# Altium project Toffee.PrjPCB
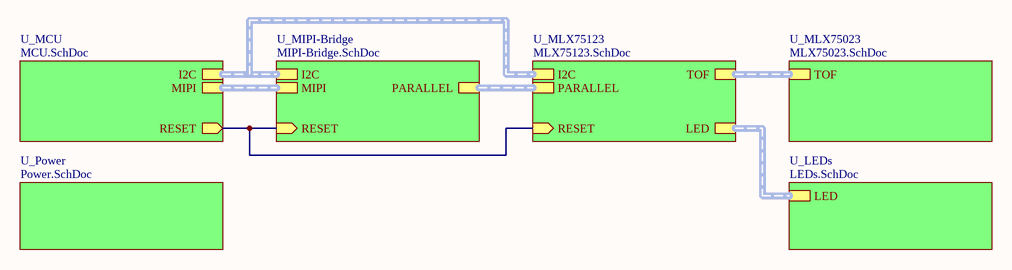
[diagram p0: Toffee.SchDoc]
7 sheets, 139 parts. Net scope: hierarchical (ports join the sheet entries above them; power ports are global).
Board file: Toffee.PcbDoc
Sheets:
  Toffee.SchDoc
    U_Power = Power.SchDoc
    U_MCU = MCU.SchDoc
    U_LEDs = LEDs.SchDoc
    U_MIPI-Bridge = MIPI-Bridge.SchDoc
    U_MLX75123 = MLX75123.SchDoc
    U_MLX75023 = MLX75023.SchDoc

## Sheet Toffee.SchDoc
size A

### Sub-sheets
U_LEDs = LEDs.SchDoc: LED (harness LED)
U_MCU = MCU.SchDoc: I2C (harness I2C), MIPI (harness MIPI), RESET (out)
U_MIPI-Bridge = MIPI-Bridge.SchDoc: I2C (harness I2C), PARALLEL (harness Parallel), MIPI (harness MIPI), RESET (in)
U_MLX75023 = MLX75023.SchDoc: TOF (harness TOF)
U_MLX75123 = MLX75123.SchDoc: PARALLEL (harness Parallel), I2C (harness I2C), TOF (harness TOF), LED (harness LED), RESET (in)
U_Power = Power.SchDoc: no entries

### Nets
NetU1_F4: sheet U_MCU/RESET, sheet U_MIPI-Bridge/RESET, sheet U_MLX75123/RESET

### Buses and harness runs
harness sheet U_LEDs/LED = sheet U_MLX75123/LED
harness sheet U_MCU/I2C = sheet U_MIPI-Bridge/I2C = sheet U_MLX75123/I2C
harness sheet U_MCU/MIPI = sheet U_MIPI-Bridge/MIPI
harness sheet U_MIPI-Bridge/PARALLEL = sheet U_MLX75123/PARALLEL
harness sheet U_MLX75023/TOF = sheet U_MLX75123/TOF

## Sheet Power.SchDoc
size A
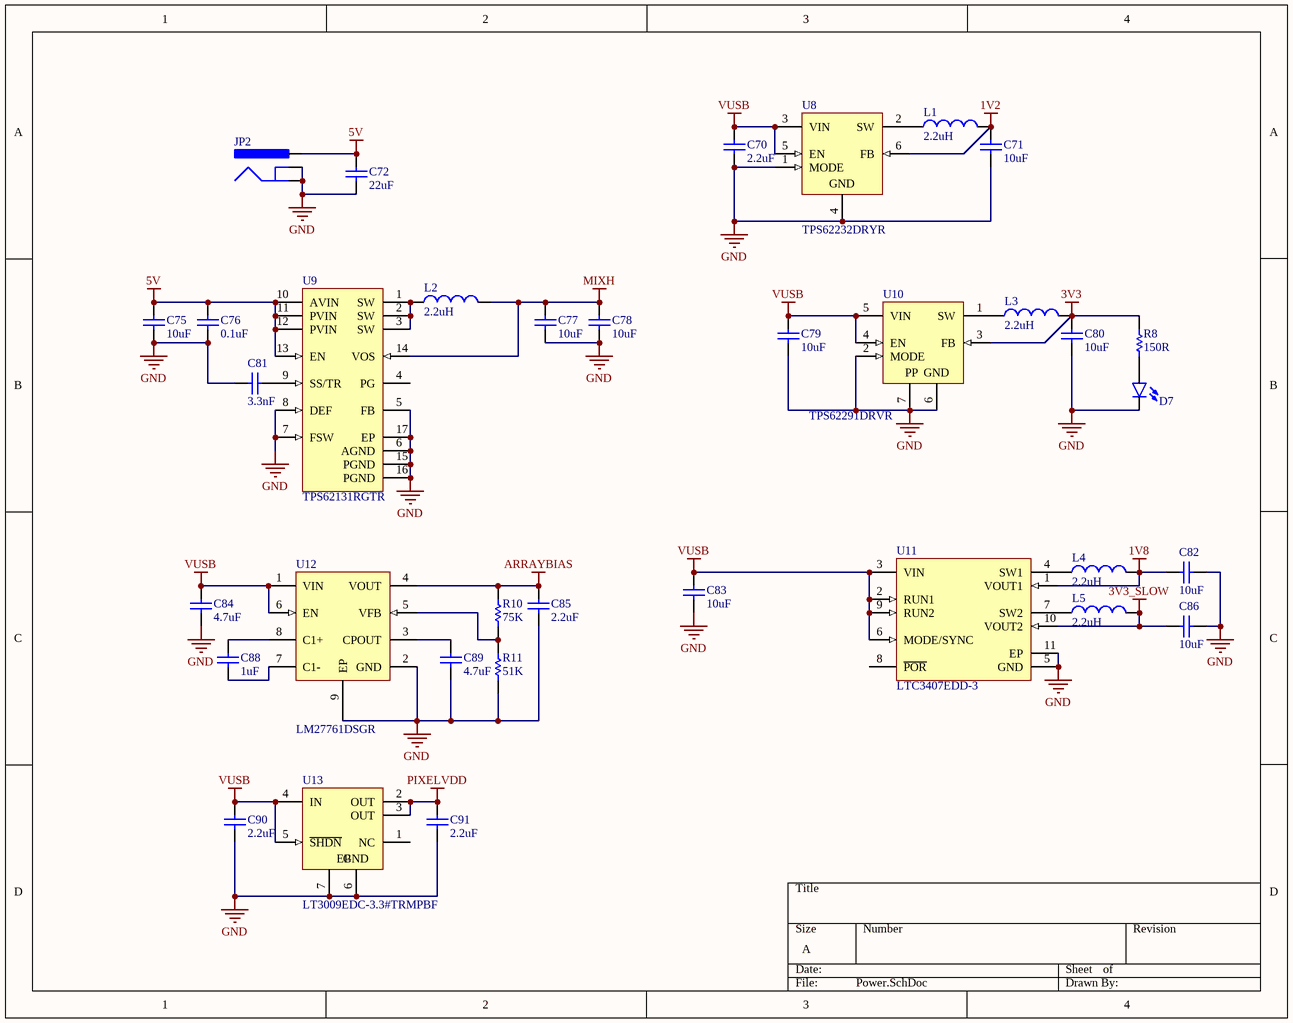
[diagram p1: Power.SchDoc]

### Parts
C70  value 2.2uF  [C0402[1005X55]]  (hidden comment: 2.2uF 6.3V 0402)
C71  value 10uF  [C0402[1005X55]]  (hidden comment: 10uF 6.3V 0402)
C72  value 22uF  [C0603[1608X92]]  (hidden comment: 22uF 6.3V 0603)
C75  value 10uF  [C0402[1005X55]]  (hidden comment: 10uF 6.3V 0402)
C76  value 0.1uF  [C0402[1005X55]]  (hidden comment: 0.1uF 6.3V 0402)
C77  value 10uF  [C0402[1005X55]]  (hidden comment: 10uF 6.3V 0402)
C78  value 10uF  [C0402[1005X55]]  (hidden comment: 10uF 6.3V 0402)
C79  value 10uF  [C0402[1005X55]]  (hidden comment: 10uF 6.3V 0402)
C80  value 10uF  [C0402[1005X55]]  (hidden comment: 10uF 6.3V 0402)
C81  value 3.3nF  [C0402[1005X55]]  (hidden comment: 3.3nF 50V 0402)
C82  value 10uF  [C0402[1005X55]]  (hidden comment: 10uF 6.3V 0402)
C83  value 10uF  [C0402[1005X55]]  (hidden comment: 10uF 6.3V 0402)
C84  value 4.7uF  [C0402[1005X55]]  (hidden comment: 4.7uF 6.3V 0402)
C85  value 2.2uF  [C0402[1005X55]]  (hidden comment: 2.2uF 6.3V 0402)
C86  value 10uF  [C0402[1005X55]]  (hidden comment: 10uF 6.3V 0402)
C88  value 1uF  [C0402[1005X55]]  (hidden comment: 1uF 6.3V 0402)
C89  value 4.7uF  [C0402[1005X55]]  (hidden comment: 4.7uF 6.3V 0402)
C90  value 2.2uF  [C0402[1005X55]]  (hidden comment: 2.2uF 6.3V 0402)
C91  value 2.2uF  [C0402[1005X55]]  (hidden comment: 2.2uF 6.3V 0402)
D7  LED_0603_BLUE_5mA  [LED0603]  (value not drawn)
JP2  POWER_JACK  [POWER-JACK-2.1X5.5MM-SMD]  (value not drawn)
L1  2.2uH  [IND0603]
L2  2.2uH  [IND1008]
L3  2.2uH  [IND0805]
L4  2.2uH  [IND0603]
L5  2.2uH  [IND0603]
R8  value 150R  [R0402[1005]]  (hidden comment: 150R 1% 0402)
R10  value 75K  [R0402[1005]]  (hidden comment: 75K 1% 0402)
R11  value 51K  [R0402[1005]]  (hidden comment: 51K 1% 0402)
U8  TPS62232DRYR  [DRY0006A]
U9  TPS62131RGTR  [RGT0016C_V]
U10  TPS62291DRVR  [WSON-6]
U11  LTC3407EDD-3  [VSON-10 (3mmx3mm)]
U12  LM27761DSGR  [WSON-8]
U13  LT3009EDC-3.3#TRMPBF  [LT-DC6-6_V]

### Nets
1V2: C71.2 L1.2 U8.6(FB)
1V8: C82.2 L4.2 U11.1(VOUT1)
3V3: C80.2 L3.2 R8.2 U10.3(FB)
3V3_SLOW: C86.1 L5.2 U11.10(VOUT2)
5V: C72.2 C75.2 C76.2 JP2.1(PWR) U9.10(AVIN) U9.11(PVIN) U9.12(PVIN) U9.13(EN)
ARRAYBIAS: C85.2 R10.2 U12.4(VOUT)
GND: C70.1 C71.1 C72.1 C75.1 C76.1 C77.1 C78.1 C79.1 C80.1 C81.1 C82.1 C83.1 C84.1 C85.1 C86.2 C89.1 C90.1 C91.1 D7.C JP2.2(GND) JP2.3(GND) R11.1 U8.1(MODE) U8.4(GND) U9.5(FB) U9.6(AGND) U9.7(FSW) U9.8(DEF) U9.15(PGND) U9.16(PGND) U9.17(EP) U10.2(MODE) U10.6(GND) U10.7(EP) U11.5(GND) U11.11(EP) U12.2(GND) U12.9(EP) U13.6(GND) U13.7(EP)
MIXH: C77.2 C78.2 L2.2 U9.14(VOS)
PIXELVDD: C91.2 U13.2(OUT) U13.3(OUT)
VUSB: C70.2 C79.2 C83.2 C84.2 C90.2 U8.3(VIN) U8.5(EN) U10.4(EN) U10.5(VIN) U11.2(RUN1) U11.3(VIN) U11.6(MODE/SYNC) U11.9(RUN2) U12.1(VIN) U12.6(EN) U13.4(IN) U13.5(~{SHDN})
NetC81_2: C81.2 U9.9(SS/TR)
NetC88_1: C88.1 U12.7(C1-)
NetC88_2: C88.2 U12.8(C1+)
NetC89_2: C89.2 U12.3(CPOUT)
NetD7_A: D7.A R8.1
NetL1_1: L1.1 U8.2(SW)
NetL2_1: L2.1 U9.1(SW) U9.2(SW) U9.3(SW)
NetL3_1: L3.1 U10.1(SW)
NetL4_1: L4.1 U11.4(SW1)
NetL5_1: L5.1 U11.7(SW2)
NetR10_1: R10.1 R11.2 U12.5(VFB)

Not connected (* = marked no-connect by the designer): U9 4(PG); U11 8(~{POR}); U13 1(NC)

### Notes on the sheet
- (in symbol TPS62291DRVR) PP

### Library data of the parts
C70 C85 C90 C91 = CAP_2.2uF_6.3V_0402_20%: 2.2uF 6.3V 20% 0402 (1005 Metric); PartNumber: GRM155R60J225ME15D; Manufacturer: Murata; Mounting Technology: Surface Mount; PackageReference: 0402; PackageDescription: 0402 (1005 Metric); Voltage: 6.3V; Tolerance: 20%
C71 C75 C77-C80 C82 C83 C86 = CAP_10uF_6.3V_0402_20%: 10uF 6.3V 20% 0402 (1005 Metric); PartNumber: GRM155R60J106ME44D; Manufacturer: Murata; Mounting Technology: Surface Mount; PackageReference: 0402; PackageDescription: 0402 (1005 Metric); Voltage: 6.3V; Tolerance: 20%
C72 = CAP_22uF_6.3V_0603_10%: 22uF 6.3V 10% 0603 (1608 Metric); PartNumber: GRT188R60J226ME13D; Manufacturer: Murata; Mounting Technology: Surface Mount; PackageReference: 0603; PackageDescription: 0603 (1608 Metric); Voltage: 6.3V; Tolerance: 10%
C76 = CAP_0.1uF_6.3V_0402_10%: 0.1uF 6.3V 10% 0402 (1005 Metric); PartNumber: GRM155R70J104KA01D; Manufacturer: Murata; Mounting Technology: Surface Mount; PackageReference: 0402; PackageDescription: 0402 (1005 Metric); Voltage: 6.3V; Tolerance: 10%
C81 = CAP_3.3nF_50V_0402_10%: 3.3nF 50V 10% 0402 (1005 Metric); PartNumber: GRM155R71H332KA01D; Manufacturer: Murata; Mounting Technology: Surface Mount; PackageReference: 0402; PackageDescription: 0402 (1005 Metric); Voltage: 50V; Tolerance: 10%
C84 C89 = CAP_4.7uF_6.3V_0402_20%: 4.7uF 6.3V 20% 0402 (1005 Metric); PartNumber: GRM155R60J475ME47D; Manufacturer: Murata; Mounting Technology: Surface Mount; PackageReference: 0402; PackageDescription: 0402 (1005 Metric); Voltage: 6.3V; Tolerance: 20%
C88 = CAP_1uF_6.3V_0402_10%: 1uF 6.3V 10% 0402 (1005 Metric); PartNumber: GRM155R70J105KA12D; Manufacturer: Murata; Mounting Technology: Surface Mount; PackageReference: 0402; PackageDescription: 0402 (1005 Metric); Voltage: 6.3V; Tolerance: 10%
D7 = LED_0603_BLUE_5mA: PartNumber: LTST-C193TBKT-5A; Manufacturer: Lite-On Inc.; PackageReference: 0603; PackageDescription: 0603 (1608 Metric); Mounting Technology: Surface Mount
JP2 = POWER_JACK: Manufacturer: CUI Inc.; PartNumber: PJ-036AH-SMT-TR; Mounting Technology: Surface Mount; PackageReference: 2X5.5MM
L1 L4 L5 = IND_2.2uH_750mA_0603_20%: 2.2uH 20% 750mA 0603; PartNumber: LQM18PZ2R2MCHD; Manufacturer: Murata; PackageReference: 0603; PackageDescription: 0603 (1608 metric); Value: 2.2uH; Mounting Technology: Surface Mount; Current: 750mA
L2 = IND_2.2uH_3.3A_1008_20%: 2.2uH 20% 3.3A 1008; PartNumber: DFE252012F-2R2M=P2; Manufacturer: Murata; PackageReference: 1008; PackageDescription: 1008 (2520 metric); Mounting Technology: Surface Mount; Current: 3.3A; Value: 2.2uH
L3 = IND_2.2uH_1.7A_0805_20%: 2.2uH 20% 1.7A 0805; PartNumber: LQM21PN2R2MGHL; Manufacturer: Murata; PackageReference: 0805; PackageDescription: 0805 (2012 metric); Value: 2.2uH; Mounting Technology: Surface Mount; Current: 1.7A
R8 = RES_150R_0402_1%: 150R 0.063W 1% 0402 (1005 Metric); Manufacturer: KOA Speer; PartNumber: RK73H1ETTP1500F; Tolerance: 1%; Power: 0.063W; Mounting Technology: Surface Mount; PackageReference: 0402; PackageDescription: 0402 (1005 Metric); ComponentLink1Description: Datasheet; ComponentLink1URL: http://www.koaspeer.com/catimages/Products/RK73H/RK73H.pdf
R10 = RES_75K_0402_1%: 75K 0.063W 1% 0402 (1005 Metric); Manufacturer: KOA Speer; PartNumber: RK73H1ETTP7502F; Tolerance: 1%; Power: 0.063W; Mounting Technology: Surface Mount; PackageReference: 0402; PackageDescription: 0402 (1005 Metric); ComponentLink1Description: Datasheet; ComponentLink1URL: http://www.koaspeer.com/catimages/Products/RK73H/RK73H.pdf
R11 = RES_51K_0402_1%: 51K 0.063W 1% 0402 (1005 Metric); Manufacturer: KOA Speer; PartNumber: RK73H1ETTP5102F; Tolerance: 1%; Power: 0.063W; Mounting Technology: Surface Mount; PackageReference: 0402; PackageDescription: 0402 (1005 Metric); ComponentLink1Description: Datasheet; ComponentLink1URL: http://www.koaspeer.com/catimages/Products/RK73H/RK73H.pdf
U8 = CMP-0323-00291-3: Buck Step Down Regulator with 2.05 to 6 V Input and 1.2 V Output, -40 to 85 degC, 6-Pin SON (DRY), Green (RoHS & no Sb/Br); Manufacturer: Texas Instruments; Synchronous Rectification: TRUE; Duty Cycle(Max)(%): 100; Iout(Max)(A): 0.5; Switch Current Limit(Typ)(A): 0.84; Vout(Min)(V): 1.2; Rating: Catalog; Vin(Max)(V): 6; SubFamily: Step-Down Regulator; Vin(Min)(V): 2.05; Iq(Typ)(mA): 0.022; Regulated Outputs(#): 1; ComponentLink1URL: http://www.ti.com/general/docs/lit/getliterature.tsp?genericPartNumber=TPS62232&fileType=pdf; ComponentLink3Description: URL Link1; PackageDescription: 6-Pin Plastic Small Outline No-Lead, 1 x 1.45 x 0.6 mm Body, 0.5 mm Pitch; ComponentLink2URL: http://www.ti.com/litv/pdf/mpds221e; Topology: Buck; DatasheetVersion: SLVS941E; PackageReference: DRY0006A; PartNumber: TPS62232DRYR; ComponentLink2Description: Package Specification; ComponentLink1Description: Datasheet; Preset Vout(V): 1.2; Mounting Technology: Surface Mount; Eco-Plan: Green (RoHS & no Sb/Br); ComponentLink3URL: Samples URL:http://www.ti.com/product/tps62232#samples; Vout(Max)(V): 1.2; PackageVersion: revF, Dec-2011
U9 = CMP-0323-00113-2: Buck Step Down Regulator with 3 to 17 V Input and 1.8 V Output, -40 to 85 degC, 16-Pin QFN (RGT), Green (RoHS & no Sb/Br); Manufacturer: Texas Instruments; Duty Cycle(Max)(%): 100; Vin(Max)(V): 17; Switch Current Limit(Typ)(A): 4.2; Iq(Typ)(mA): 0.017; Preset Vout(V): 1.8; Synchronous Rectification: TRUE; SubFamily: Step-Down Regulator; Regulated Outputs(#): 1; Vin(Min)(V): 3; Rating: Catalog; DatasheetVersion: SLVSAG7; ComponentLink2URL: Samples URL:http://www.ti.com/product/tps62131#samples; Topology: Buck; PackageVersion: revH, Oct-2011; Vout(Max)(V): 1.8; PackageDescription: 16-Pin Plastic Quad Flat No-Lead, 3 x 3 mm Body, 0.5 mm Pitch, 1.7 x 1.7 mm Exposed Pad; ComponentLink2Description: URL Link1; Vout(Min)(V): 1.8; Eco-Plan: Green (RoHS & no Sb/Br); ComponentLink1Description: Datasheet; ComponentLink1URL: http://www.ti.com/general/docs/lit/getliterature.tsp?genericPartNumber=TPS62131&fileType=pdf; PackageReference: RGT0016C; PartNumber: TPS62131RGTR; Iout(Max)(A): 3; Code_JEDEC: MO-220; Mounting Technology: Surface Mount
U10 = TPS62291DRVR: Voltage Regulators - Switching Regulators 2.25MHz 1A Step-Down Cnvrtr 3.3V Output; Manufacturer: Texas Instruments; PartNumber: TPS62291DRVR; PackageReference: WSON-6; PackageDescription: SON, 6-Leads, Body 2x2mm, Pitch 0.65mm, Thermal Pad 1.6x1mm, TI Recommended; Mounting Technology: Surface Mount
U11 = LTC3407EDD-3: Manufacturer: Linear Technology; PartNumber: LTC3407EDD-3; PackageReference: SON-10; Mounting Technology: Surface Mount
U12 = LM27761DSGR: Switching Voltage Regulators Switch Cap Boost; Manufacturer: Texas Instruments; PartNumber: LM27761DSGR; Mounting Technology: Surface Mount; PackageReference: WSON-8
U13 = CMP-0476-00025-3: 3 uA IQ, 20 mA Low Dropout Linear Regulator, 1.6 to 20 V Vin, 3.3 V Vout, 6-pin SON (DC6-6), -40 to 125 degC, Pb-Free, Mini Tape and Reel; Manufacturer: Linear Technology; Vin Max(V): 20; Isupply(mA): 0.003; Discrete Pass Element: no; Vin Min(V): 1.6; Output Voltage: 3.3 V; Dropout Voltage(V): 0.28; PSRR(dB): 61; Number of Outputs: 1; Noise(uV): 150; PackageReference: DC6-6; PackageVersion: Rev. B, 06/2010; ComponentLink3URL: http://cds.linear.com/docs/en/packaging/DFN_6_05-08-1703.pdf; Code_JEDEC: MO-229; Mounting Technology: Surface Mount; ComponentLink2URL: http://cds.linear.com/docs/en/datasheet/3009fd.pdf; Iout(mA): 20; ComponentLink3Description: Package Specification; Packing: Mini Tape and Reel; ComponentLink1URL: http://www.linear.com/; RoHS: TRUE; DatasheetVersion: Rev. D; ComponentLink1Description: Manufacturer URL; PartNumber: LT3009EDC-3.3#TRMPBF; Shutdown Current(uA): 1; PackageDescription: 6-Pin Plastic DFN, Body 2 x 2 mm, Pitch 0.5 mm; ComponentLink2Description: Datasheet

## Sheet MCU.SchDoc
size A
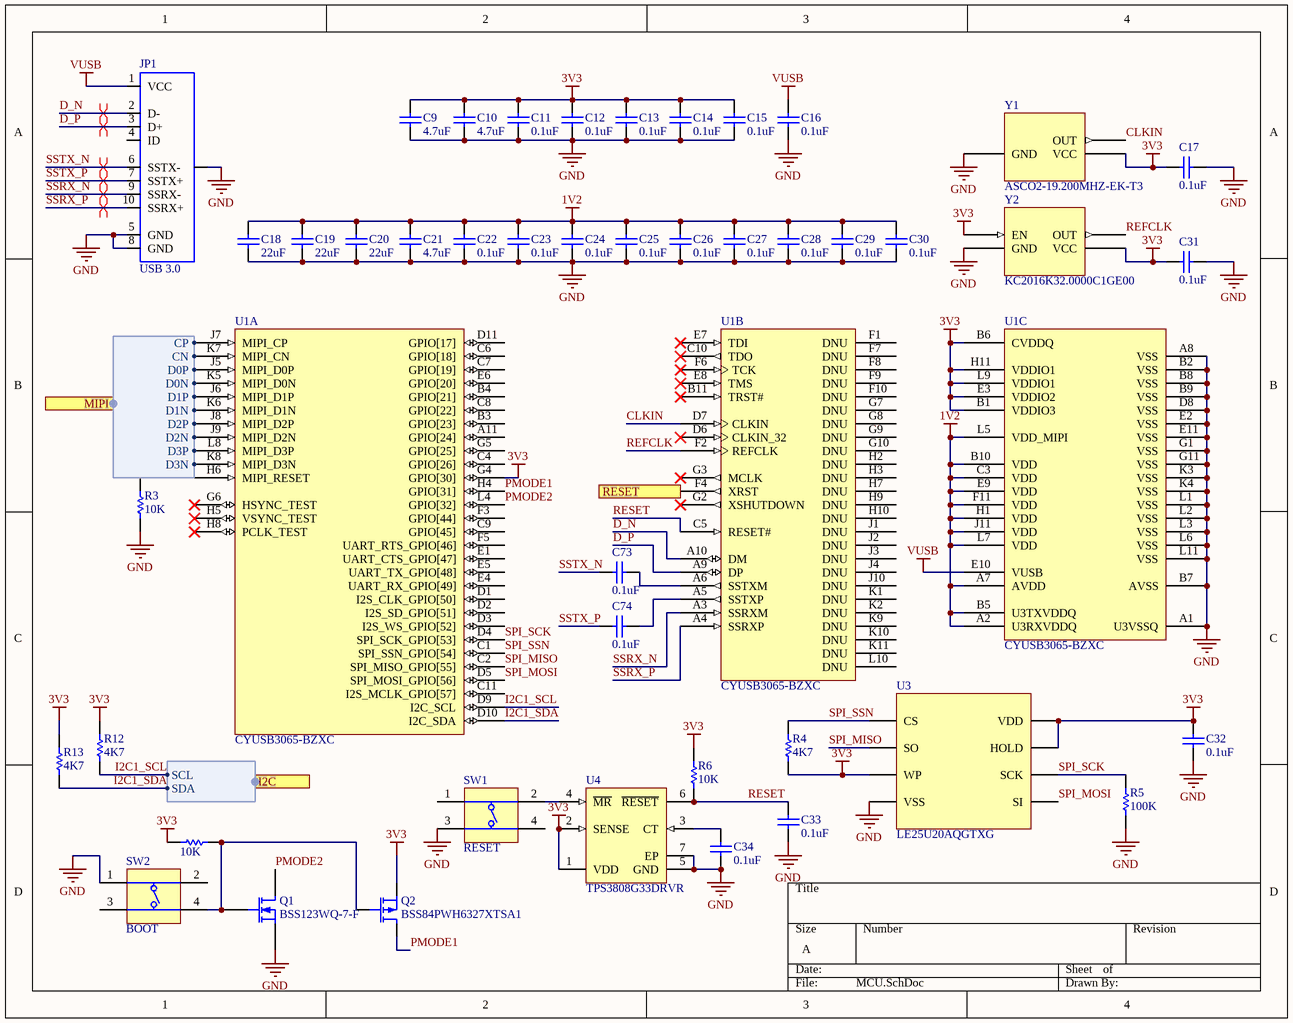
[diagram p2: MCU.SchDoc]

### Parts
C9  value 4.7uF  [C0402[1005X55]]  (hidden comment: 4.7uF 6.3V 0402)
C10  value 4.7uF  [C0402[1005X55]]  (hidden comment: 4.7uF 6.3V 0402)
C11  value 0.1uF  [C0402[1005X55]]  (hidden comment: 0.1uF 6.3V 0402)
C12  value 0.1uF  [C0402[1005X55]]  (hidden comment: 0.1uF 6.3V 0402)
C13  value 0.1uF  [C0402[1005X55]]  (hidden comment: 0.1uF 6.3V 0402)
C14  value 0.1uF  [C0402[1005X55]]  (hidden comment: 0.1uF 6.3V 0402)
C15  value 0.1uF  [C0402[1005X55]]  (hidden comment: 0.1uF 6.3V 0402)
C16  value 0.1uF  [C0402[1005X55]]  (hidden comment: 0.1uF 6.3V 0402)
C17  value 0.1uF  [C0402[1005X55]]  (hidden comment: 0.1uF 6.3V 0402)
C18  value 22uF  [C0603[1608X92]]  (hidden comment: 22uF 6.3V 0603)
C19  value 22uF  [C0603[1608X92]]  (hidden comment: 22uF 6.3V 0603)
C20  value 22uF  [C0603[1608X92]]  (hidden comment: 22uF 6.3V 0603)
C21  value 4.7uF  [C0402[1005X55]]  (hidden comment: 4.7uF 6.3V 0402)
C22  value 0.1uF  [C0402[1005X55]]  (hidden comment: 0.1uF 6.3V 0402)
C23  value 0.1uF  [C0402[1005X55]]  (hidden comment: 0.1uF 6.3V 0402)
C24  value 0.1uF  [C0402[1005X55]]  (hidden comment: 0.1uF 6.3V 0402)
C25  value 0.1uF  [C0402[1005X55]]  (hidden comment: 0.1uF 6.3V 0402)
C26  value 0.1uF  [C0402[1005X55]]  (hidden comment: 0.1uF 6.3V 0402)
C27  value 0.1uF  [C0402[1005X55]]  (hidden comment: 0.1uF 6.3V 0402)
C28  value 0.1uF  [C0402[1005X55]]  (hidden comment: 0.1uF 6.3V 0402)
C29  value 0.1uF  [C0402[1005X55]]  (hidden comment: 0.1uF 6.3V 0402)
C30  value 0.1uF  [C0402[1005X55]]  (hidden comment: 0.1uF 6.3V 0402)
C31  value 0.1uF  [C0402[1005X55]]  (hidden comment: 0.1uF 6.3V 0402)
C32  value 0.1uF  [C0402[1005X55]]  (hidden comment: 0.1uF 6.3V 0402)
C33  value 0.1uF  [C0402[1005X55]]  (hidden comment: 0.1uF 6.3V 0402)
C34  value 0.1uF  [C0402[1005X55]]  (hidden comment: 0.1uF 100V 0402)
C73  value 0.1uF  [C0402[1005X55]]  (hidden comment: 0.1uF 6.3V 0402)
C74  value 0.1uF  [C0402[1005X55]]  (hidden comment: 0.1uF 6.3V 0402)
JP1  USB 3.0  [USB-MICROB-3.0]
Q1  BSS123WQ-7-F  [SOT323-3]
Q2  BSS84PWH6327XTSA1  [SOT323-3]
R3  value 10K  [R0402[1005]]  (hidden comment: 10K 1% 0402)
R4  value 4K7  [R0402[1005]]  (hidden comment: 4K7 1% 0402)
R5  value 100K  [R0402[1005]]  (hidden comment: 100K 1% 0402)
R6  value 10K  [R0402[1005]]  (hidden comment: 10K 1% 0402)
R12  value 4K7  [R0402[1005]]  (hidden comment: 4K7 1% 0402)
R13  value 4K7  [R0402[1005]]  (hidden comment: 4K7 1% 0402)
SW1  RESET  [SWITCH]
SW2  BOOT  [SWITCH]
U1  CYUSB3065-BZXC  [BGA-121]  (parts A,B,C of 3)
U3  LE25U20AQGTXG  [WDFN-8 (2x3MM)]
U4  TPS3808G33DRVR  [WSON-6]
Y1  ASCO2-19.200MHZ-EK-T3  [ASCO]
Y2  KC2016K32.0000C1GE00  [KC2016K]
  value 10K  [R0402[1005]]  (hidden comment: 10K 1% 0402)

### Ports
I2C (harness I2C), MIPI (harness MIPI), RESET (out)

### Harnesses
I2C: SCL, SDA
MIPI: CP, CN, D0P, D0N, D1P, D1N, D2P, D2N, D3P, D3N

### Nets
1V2: C18.2 C19.2 C20.2 C21.2 C22.2 C23.2 C24.2 C25.2 C26.2 C27.2 C28.2 C29.2 C30.2 U1.A2(U3RXVDDQ) U1.A7(AVDD) U1.B5(U3TXVDDQ) U1.B10(VDD) U1.C3(VDD) U1.E9(VDD) U1.F11(VDD) U1.H1(VDD) U1.J11(VDD) U1.L5(VDD_MIPI) U1.L7(VDD)
3V3: C9.2 C10.2 C11.2 C12.2 C13.2 C14.2 C15.2 C17.2 C31.2 C32.2 Q2.2(S) R4.1 R6.2 R12.2 R13.2 U1.B1(VDDIO3) U1.B6(CVDDQ) U1.E3(VDDIO2) U1.G4(GPIO[30]) U1.H11(VDDIO1) U1.L9(VDDIO1) U3.3(WP) U3.7(HOLD) U3.8(VDD) U4.1(VDD) U4.2(SENSE) Y1.4(VCC) Y2.1(EN) Y2.4(VCC) .2
GND: C9.1 C10.1 C11.1 C12.1 C13.1 C14.1 C15.1 C16.1 C17.1 C18.1 C19.1 C20.1 C21.1 C22.1 C23.1 C24.1 C25.1 C26.1 C27.1 C28.1 C29.1 C30.1 C31.1 C32.1 C33.1 C34.1 JP1.5(GND) JP1.8(GND) JP1.11(SHIELD) Q1.2(S) R3.1 R5.1 SW1.3(T3) SW2.1(T1) U1.A1(U3VSSQ) U1.A8(VSS) U1.B2(VSS) U1.B7(AVSS) U1.B8(VSS) U1.B9(VSS) U1.D8(VSS) U1.E2(VSS) U1.E11(VSS) U1.G1(VSS) U1.G11(VSS) U1.K3(VSS) U1.K4(VSS) U1.L1(VSS) U1.L2(VSS) U1.L3(VSS) U1.L6(VSS) U1.L11(VSS) U3.4(VSS) U4.5(GND) U4.7(EP) Y1.2(GND) Y2.2(GND)
VUSB: C16.2 JP1.1(VCC) U1.E10(VUSB)
CLKIN: U1.D7(CLKIN) Y1.3(OUT)
D_N: JP1.2(D-) U1.A10(DM)
D_P: JP1.3(D+) U1.A9(DP)
I2C1_SCL: R12.1 U1.D9(I2C_SCL) ; port I2C.SCL
I2C1_SDA: R13.1 U1.D10(I2C_SDA) ; port I2C.SDA
MIPI_C_N: U1.K7(MIPI_CN) ; port MIPI.CN
MIPI_C_P: U1.J7(MIPI_CP) ; port MIPI.CP
MIPI_D0_N: U1.K5(MIPI_D0N) ; port MIPI.D0N
MIPI_D0_P: U1.J5(MIPI_D0P) ; port MIPI.D0P
MIPI_D1_N: U1.K6(MIPI_D1N) ; port MIPI.D1N
MIPI_D1_P: U1.J6(MIPI_D1P) ; port MIPI.D1P
MIPI_D2_N: U1.J9(MIPI_D2N) ; port MIPI.D2N
MIPI_D2_P: U1.J8(MIPI_D2P) ; port MIPI.D2P
MIPI_D3_N: U1.K8(MIPI_D3N) ; port MIPI.D3N
MIPI_D3_P: U1.L8(MIPI_D3P) ; port MIPI.D3P
PMODE1: Q2.3(D) U1.H4(GPIO[31])
PMODE2: Q1.3(D) U1.L4(GPIO[32])
REFCLK: U1.F2(REFCLK) Y2.3(OUT)
RESET: C33.2 R6.1 U1.C5(RESET#) U4.6(~{RESET})
SPI_MISO: U1.C2(SPI_MISO_GPIO[55]) U3.2(SO)
SPI_MOSI: U1.D5(SPI_MOSI_GPIO[56]) U3.5(SI)
SPI_SCK: R5.2 U1.D4(SPI_SCK_GPIO[53]) U3.6(SCK)
SPI_SSN: R4.2 U1.C1(SPI_SSN_GPIO[54]) U3.1(CS)
SSRX_N: JP1.9(SSRX-) U1.A3(SSRXM)
SSRX_P: JP1.10(SSRX+) U1.A4(SSRXP)
SSTX_N: C73.1 JP1.6(SSTX-)
SSTX_P: C74.1 JP1.7(SSTX+)
NetC34_2: C34.2 U4.3(CT)
NetC73_2: C73.2 U1.A6(SSTXM)
NetC74_2: C74.2 U1.A5(SSTXP)
NetQ1_1: Q1.1(G) Q2.1(G) SW2.4(T3) .1
NetR3_2: R3.2 U1.H6(MIPI_RESET)
NetSW1_2: SW1.2(T2) U4.4(~{MR})
NetU1_F4: U1.F4(XRST) ; port RESET

Not connected (* = marked no-connect by the designer): JP1 4(ID); SW1 1(T1) 4(T3); SW2 2(T2) 3(T3); U1 A11(GPIO[24]) B3(GPIO[23]) B4(GPIO[21]) B11(TRST#)* C4(GPIO[26]) C6(GPIO[18]) C7(GPIO[19]) C8(GPIO[22]) C9(GPIO[45]) C10(TDO)* C11(I2S_MCLK_GPIO[57]) D1(I2S_CLK_GPIO[50]) D2(I2S_SD_GPIO[51]) D3(I2S_WS_GPIO[52]) D6(CLKIN_32)* D11(GPIO[17]) E1(UART_CTS_GPIO[47]) E4(UART_RX_GPIO[49]) E5(UART_TX_GPIO[48]) E6(GPIO[20]) E7(TDI)* E8(TMS)* F1(DNU) F3(GPIO[44]) F5(UART_RTS_GPIO[46]) F6(TCK)* F7(DNU) F8(DNU) F9(DNU) F10(DNU) G2(XSHUTDOWN)* G3(MCLK)* G5(GPIO[25]) G6(HSYNC_TEST)* G7(DNU) G8(DNU) G9(DNU) G10(DNU) H2(DNU) H3(DNU) H5(VSYNC_TEST)* H7(DNU) H8(PCLK_TEST)* H9(DNU) H10(DNU) J1(DNU) J2(DNU) J3(DNU) J4(DNU) J10(DNU) K1(DNU) K2(DNU) K9(DNU) K10(DNU) K11(DNU) L10(DNU)

### Layout directives
differential pair; differential pair class USB2: D_N, D_P
differential pair; differential pair class SSTX: SSTX_N, SSTX_P
differential pair; differential pair class SSRX: SSRX_N, SSRX_P

### Library data of the parts
C9 C10 C21 = CAP_4.7uF_6.3V_0402_20%: as C84 on sheet Power; Mounting Technology: Surface Mount; PackageReference: 0402; PackageDescription: 0402 (1005 Metric); Voltage: 6.3V; Tolerance: 20%
C11-C17 C22-C33 C73 C74 = CAP_0.1uF_6.3V_0402_10%: as C76 on sheet Power; Mounting Technology: Surface Mount; PackageReference: 0402; PackageDescription: 0402 (1005 Metric); Voltage: 6.3V; Tolerance: 10%
C18-C20 = CAP_22uF_6.3V_0603_10%: as C72 on sheet Power; Mounting Technology: Surface Mount; PackageReference: 0603; PackageDescription: 0603 (1608 Metric); Voltage: 6.3V; Tolerance: 10%
C34 = CAP_0.1uF_100V_0402_10%: 0.1uF 100V 10% 0402 (1005 Metric); PartNumber: GRM155R62A104KE14D; Manufacturer: Murata; Mounting Technology: Surface Mount; PackageReference: 0402; PackageDescription: 0402 (1005 Metric); Voltage: 100V; Tolerance: 10%
JP1 = USB_MICROB_3.0_SMT: PartNumber: GSB343133HR; Manufacturer: Amphenol FCI; Mounting Technology: Surface Mount; PackageReference: USB 3.0 - Micro B
Q1 = BSS123WQ-7-F: N-Channel MOSFET; Manufacturer: Diodes Incorporated; PartNumber: BSS123WQ-7-F; PackageReference: SOT-323-3; Mounting Technology: Surface Mount
Q2 = BSS84PW H6327: P-Channel MOSFET; Manufacturer: Infineon; Mounting Technology: Surface Mount; PartNumber: BSS84PWH6327XTSA1; PackageReference: SOT323-3
R3 R6  = RES_10K_0402_1%: 10K 0.063W 1% 0402 (1005 Metric); Manufacturer: KOA Speer; PartNumber: RK73H1ETTP1002F
R4 R12 R13 = RES_4K7_0402_1%: 4K7 0.063W 1% 0402 (1005 Metric); Manufacturer: KOA Speer; PartNumber: RK73H1ETTP4701F; Tolerance: 1%; Power: 0.063W; Mounting Technology: Surface Mount; PackageReference: 0402; PackageDescription: 0402 (1005 Metric); ComponentLink1Description: Datasheet; ComponentLink1URL: http://www.koaspeer.com/catimages/Products/RK73H/RK73H.pdf
R5 = RES_100K_0402_1%: 100K 0.063W 1% 0402 (1005 Metric); Manufacturer: KOA Speer; PartNumber: RK73H1ETTP1003F; Tolerance: 1%; Power: 0.063W; Mounting Technology: Surface Mount; PackageReference: 0402; PackageDescription: 0402 (1005 Metric); ComponentLink1Description: Datasheet; ComponentLink1URL: http://www.koaspeer.com/catimages/Products/RK73H/RK73H.pdf
SW1 SW2 = DIPT-DTSM-6: Switch, SPNO Push Button SMD; Manufacturer: C&K Components; PartNumber: PTS810 SJM 250 SMTR LFS; Packing Type: Tape&Reel; Mechanical Life: 200,000 cycles; ComponentLink2URL: http://www.dip.com.tw/Products_tact.htm; ComponentLink1URL: http://www.dip.com.tw/; ComponentLink3URL: http://www.dip.com.tw/PDF/pro_tact/DTSM_G_-6_2_-V.pdf; PackageDescription: Switch, Surface Mount, 4 Leads, Body 4.6x2.8mm, Height 1.9mm; ComponentLink2Description: Datasheet; ComponentLink3Description: Package Specification; ComponentLink1Description: Manufacturer URL; PackageReference: PTS810; Mounting Technology: Surface Mount
U1 = CYUSB3065-BZXCXC: MCU MIPI CSI-2 to USB Bridge Controller; Manufacturer: Cypress Semiconductor; Mounting Technology: Surface Mount; PartNumber: CYUSB3065-BZXC; PackageReference: BGA-121
U3 = LE25U20AQGTXG: IC FLASH 2M SPI 30MHZ 8WDFN; Manufacturer: ON Semiconductor; PartNumber: LE25U20AQGTXG; Mounting Technology: Surface Mount; PackageReference: WDFN-8
U4 = TPS3808G33DRVR: IC VOLT SUPERVISOR 3.3V; Manufacturer: Texas Instruments; PackageReference: WSON-6; Mounting Technology: Surface Mount; PartNumber: TPS3808G33DRVR
Y1 = ASCO2-19.200MHZ-EK-T3: OSC XO 19.2MHZ CMOS SMD; Manufacturer: Abracon; PartNumber: ASCO2-19.200MHZ-EK-T3; Mounting Technology: Surface Mount; PackageReference: SMD-4
Y2 = KC2016K32.0000C1GE00: OSC XO 32.0000MHZ CMOS SMD; Manufacturer: Kyocera; PartNumber: KC2016K32.0000C1GE00; Mounting Technology: Surface Mount; PackageReference: SMD-4

## Sheet LEDs.SchDoc
size A
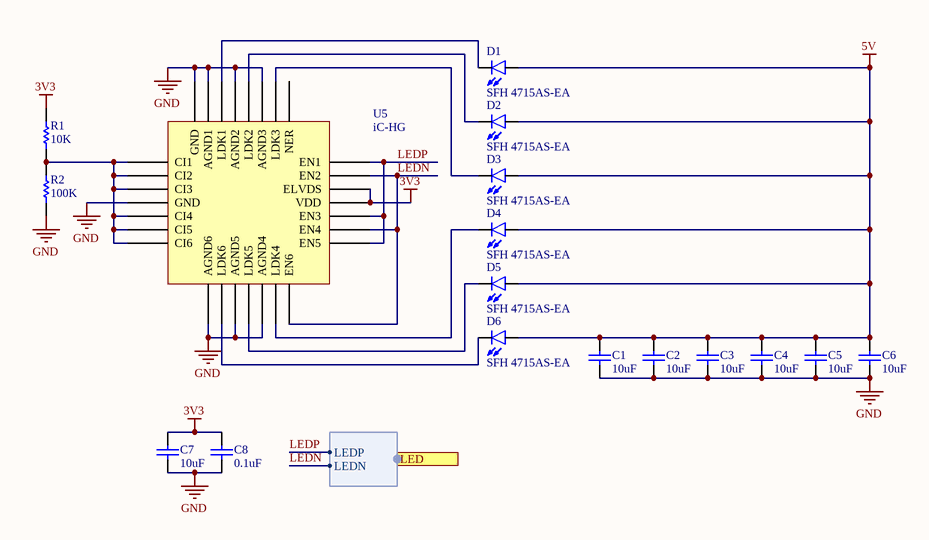
[diagram p3: LEDs.SchDoc]

### Parts
C1  value 10uF  [C0402[1005X55]]  (hidden comment: 10uF 6.3V 0402)
C2  value 10uF  [C0402[1005X55]]  (hidden comment: 10uF 6.3V 0402)
C3  value 10uF  [C0402[1005X55]]  (hidden comment: 10uF 6.3V 0402)
C4  value 10uF  [C0402[1005X55]]  (hidden comment: 10uF 6.3V 0402)
C5  value 10uF  [C0402[1005X55]]  (hidden comment: 10uF 6.3V 0402)
C6  value 10uF  [C0402[1005X55]]  (hidden comment: 10uF 6.3V 0402)
C7  value 10uF  [C0402[1005X55]]  (hidden comment: 10uF 6.3V 0402)
C8  value 0.1uF  [C0402[1005X55]]  (hidden comment: 0.1uF 6.3V 0402)
D1  SFH 4715AS-EA  [SFH 4715AS]
D2  SFH 4715AS-EA  [SFH 4715AS]
D3  SFH 4715AS-EA  [SFH 4715AS]
D4  SFH 4715AS-EA  [SFH 4715AS]
D5  SFH 4715AS-EA  [SFH 4715AS]
D6  SFH 4715AS-EA  [SFH 4715AS]
R1  value 10K  [R0402[1005]]  (hidden comment: 10K 1% 0402)
R2  value 100K  [R0402[1005]]  (hidden comment: 100K 1% 0402)
U5  iC-HG  [QFN-28]

### Ports
LED (harness LED)

### Harnesses
LED: LEDP, LEDN

### Nets
3V3: C7.2 C8.2 R1.2 U5.18(VDD) U5.19(ELVDS)
5V: C1.2 C2.2 C3.2 C4.2 C5.2 C6.2 D1.A D2.A D3.A D4.A D5.A D6.A
GND: C1.1 C2.1 C3.1 C4.1 C5.1 C6.1 C7.1 C8.1 R2.1 U5.4(GND) U5.8(AGND6) U5.10(AGND5) U5.12(AGND4) U5.24(AGND3) U5.26(AGND2) U5.28(AGND1) U5.29(GND)
LEDN: U5.14(EN6) U5.16(EN4) U5.20(EN2) ; port LED.LEDN
LEDP: U5.15(EN5) U5.17(EN3) U5.21(EN1) ; port LED.LEDP
NetD1_C: D1.C U5.27(LDK1)
NetD2_C: D2.C U5.25(LDK2)
NetD3_C: D3.C U5.23(LDK3)
NetD4_C: D4.C U5.13(LDK4)
NetD5_C: D5.C U5.11(LDK5)
NetD6_C: D6.C U5.9(LDK6)
NetR1_1: R1.1 R2.2 U5.1(CI1) U5.2(CI2) U5.3(CI3) U5.5(CI4) U5.6(CI5) U5.7(CI6)

Not connected (* = marked no-connect by the designer): U5 22(NER)

### Library data of the parts
C1-C7 = CAP_10uF_6.3V_0402_20%: as C71 on sheet Power; Mounting Technology: Surface Mount; PackageReference: 0402; PackageDescription: 0402 (1005 Metric); Voltage: 6.3V; Tolerance: 20%
C8 = CAP_0.1uF_6.3V_0402_10%: as C76 on sheet Power; Mounting Technology: Surface Mount; PackageReference: 0402; PackageDescription: 0402 (1005 Metric); Voltage: 6.3V; Tolerance: 10%
D1-D6 = SFH 4715AS-EA: Manufacturer: Osram; PartNumber: SFH 4715AS-EA; Mounting Technology: Surface Mount; Package Reference: SMD-3
R1 = RES_10K_0402_1%: as R3 on sheet MCU; Tolerance: 1%; Power: 0.063W; Mounting Technology: Surface Mount; PackageReference: 0402; PackageDescription: 0402 (1005 Metric); ComponentLink1Description: Datasheet; ComponentLink1URL: http://www.koaspeer.com/catimages/Products/RK73H/RK73H.pdf
R2 = RES_100K_0402_1%: as R5 on sheet MCU; Tolerance: 1%; Power: 0.063W; Mounting Technology: Surface Mount; PackageReference: 0402; PackageDescription: 0402 (1005 Metric); ComponentLink1Description: Datasheet; ComponentLink1URL: http://www.koaspeer.com/catimages/Products/RK73H/RK73H.pdf
U5 = iC-HG QFN28-5x5: Manufacturer: iC-Haus; PartNumber: iC-HG QFN28-5x5; Mounting Technology: Surface Mount; PackageReference: QFN-28

## Sheet MIPI-Bridge.SchDoc
size A
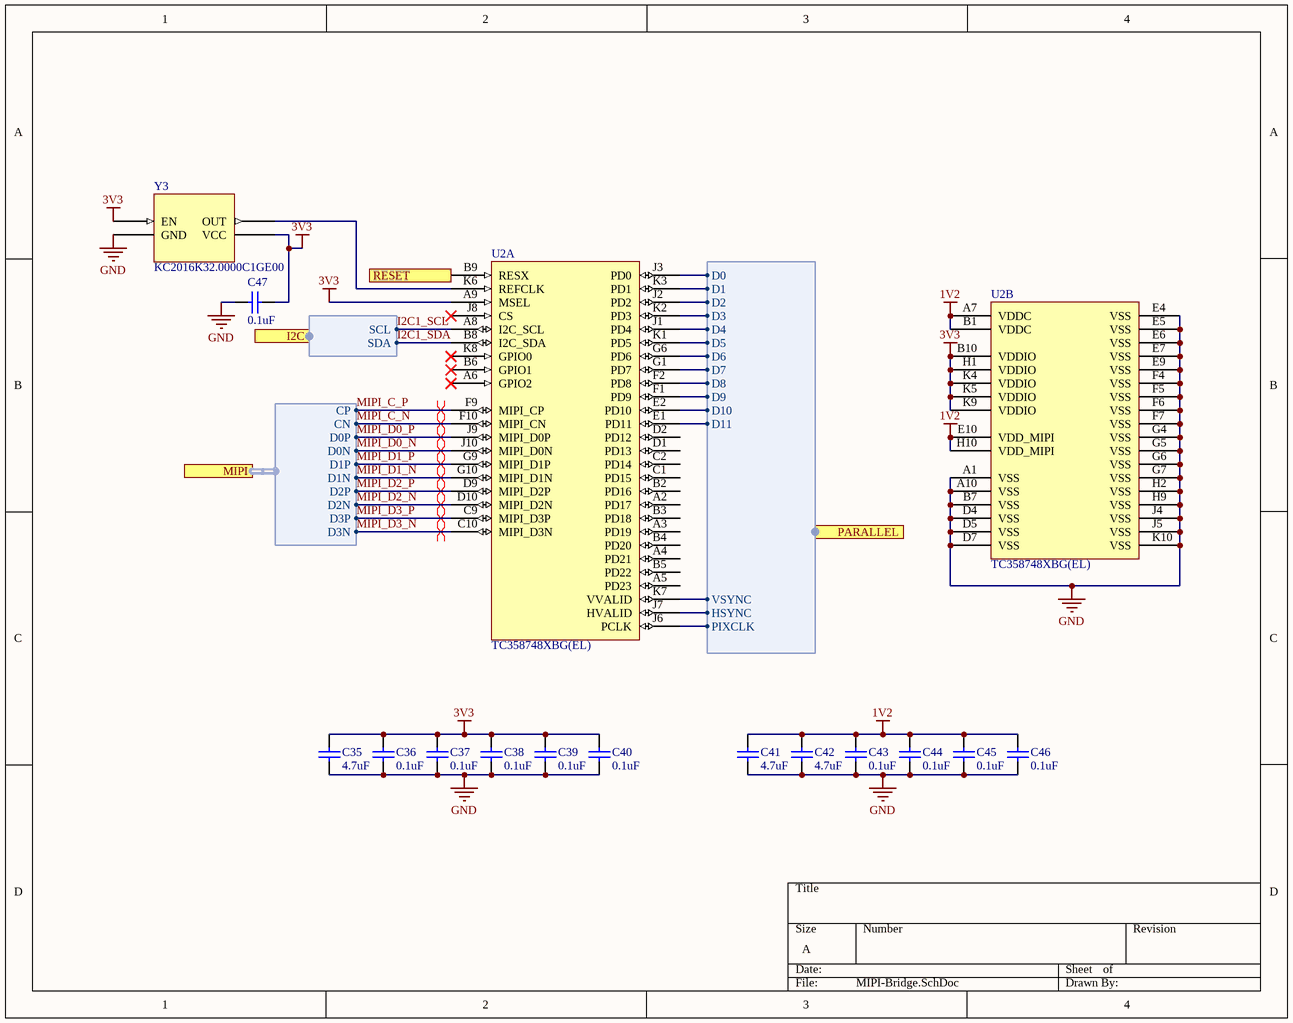
[diagram p4: MIPI-Bridge.SchDoc]

### Parts
C35  value 4.7uF  [C0402[1005X55]]  (hidden comment: 4.7uF 6.3V 0402)
C36  value 0.1uF  [C0402[1005X55]]  (hidden comment: 0.1uF 6.3V 0402)
C37  value 0.1uF  [C0402[1005X55]]  (hidden comment: 0.1uF 6.3V 0402)
C38  value 0.1uF  [C0402[1005X55]]  (hidden comment: 0.1uF 6.3V 0402)
C39  value 0.1uF  [C0402[1005X55]]  (hidden comment: 0.1uF 6.3V 0402)
C40  value 0.1uF  [C0402[1005X55]]  (hidden comment: 0.1uF 6.3V 0402)
C41  value 4.7uF  [C0402[1005X55]]  (hidden comment: 4.7uF 6.3V 0402)
C42  value 4.7uF  [C0402[1005X55]]  (hidden comment: 4.7uF 6.3V 0402)
C43  value 0.1uF  [C0402[1005X55]]  (hidden comment: 0.1uF 6.3V 0402)
C44  value 0.1uF  [C0402[1005X55]]  (hidden comment: 0.1uF 6.3V 0402)
C45  value 0.1uF  [C0402[1005X55]]  (hidden comment: 0.1uF 6.3V 0402)
C46  value 0.1uF  [C0402[1005X55]]  (hidden comment: 0.1uF 6.3V 0402)
C47  value 0.1uF  [C0402[1005X55]]  (hidden comment: 0.1uF 6.3V 0402)
U2  TC358748XBG(EL)  [BGA-80]  (parts A,B of 2)
Y3  KC2016K32.0000C1GE00  [KC2016K]

### Ports
I2C (harness I2C), MIPI (harness MIPI), PARALLEL (harness Parallel), RESET (in)

### Harnesses
I2C: SCL, SDA
Parallel: D2, D3, D1, D0, D6, D7, D5, D4, D10, D9, D8, PIXCLK, D11, HSYNC, VSYNC
MIPI: CP, CN, D0P, D0N, D1P, D1N, D2P, D2N, D3P, D3N

### Nets
1V2: C41.2 C42.2 C43.2 C44.2 C45.2 C46.2 U2.A7(VDDC) U2.B1(VDDC) U2.E10(VDD_MIPI) U2.H10(VDD_MIPI)
3V3: C35.2 C36.2 C37.2 C38.2 C39.2 C40.2 C47.1 U2.A9(MSEL) U2.B10(VDDIO) U2.H1(VDDIO) U2.K4(VDDIO) U2.K5(VDDIO) U2.K9(VDDIO) Y3.1(EN) Y3.4(VCC)
GND: C35.1 C36.1 C37.1 C38.1 C39.1 C40.1 C41.1 C42.1 C43.1 C44.1 C45.1 C46.1 C47.2 U2.A1(VSS) U2.A10(VSS) U2.B7(VSS) U2.D4(VSS) U2.D5(VSS) U2.D7(VSS) U2.E4(VSS) U2.E5(VSS) U2.E6(VSS) U2.E7(VSS) U2.E9(VSS) U2.F4(VSS) U2.F5(VSS) U2.F6(VSS) U2.F7(VSS) U2.G4(VSS) U2.G5(VSS) U2.G6(VSS) U2.G7(VSS) U2.H2(VSS) U2.H9(VSS) U2.J4(VSS) U2.J5(VSS) U2.K10(VSS) Y3.2(GND)
CSI2_D0: U2.J3(PD0) ; port PARALLEL.D0
CSI2_D1: U2.K3(PD1) ; port PARALLEL.D1
CSI2_D2: U2.J2(PD2) ; port PARALLEL.D2
CSI2_D3: U2.K2(PD3) ; port PARALLEL.D3
CSI2_D4: U2.J1(PD4) ; port PARALLEL.D4
CSI2_D5: U2.K1(PD5) ; port PARALLEL.D5
CSI2_D6: U2.G6(PD6) ; port PARALLEL.D6
CSI2_D7: U2.G1(PD7) ; port PARALLEL.D7
CSI2_D8: U2.F2(PD8) ; port PARALLEL.D8
CSI2_D9: U2.F1(PD9) ; port PARALLEL.D9
CSI2_D10: U2.E2(PD10) ; port PARALLEL.D10
CSI2_D11: U2.E1(PD11) ; port PARALLEL.D11
CSI2_HSYNC: U2.J7(HVALID) ; port PARALLEL.HSYNC
CSI2_PIXCLK: U2.J6(PCLK) ; port PARALLEL.PIXCLK
CSI2_VSYNC: U2.K7(VVALID) ; port PARALLEL.VSYNC
I2C1_SCL: U2.A8(I2C_SCL) ; port I2C.SCL
I2C1_SDA: U2.B8(I2C_SDA) ; port I2C.SDA
MIPI_C_N: U2.F10(MIPI_CN) ; port MIPI.CN
MIPI_C_P: U2.F9(MIPI_CP) ; port MIPI.CP
MIPI_D0_N: U2.J10(MIPI_D0N) ; port MIPI.D0N
MIPI_D0_P: U2.J9(MIPI_D0P) ; port MIPI.D0P
MIPI_D1_N: U2.G10(MIPI_D1N) ; port MIPI.D1N
MIPI_D1_P: U2.G9(MIPI_D1P) ; port MIPI.D1P
MIPI_D2_N: U2.D10(MIPI_D2N) ; port MIPI.D2N
MIPI_D2_P: U2.D9(MIPI_D2P) ; port MIPI.D2P
MIPI_D3_N: U2.C10(MIPI_D3N) ; port MIPI.D3N
MIPI_D3_P: U2.C9(MIPI_D3P) ; port MIPI.D3P
NetU1_F4: U2.B9(RESX) ; port RESET
NetU2_K6: U2.K6(REFCLK) Y3.3(OUT)

Not connected (* = marked no-connect by the designer): U2 A2(PD17) A3(PD19) A4(PD21) A5(PD23) A6(GPIO2)* B2(PD16) B3(PD18) B4(PD20) B5(PD22) B6(GPIO1)* C1(PD15) C2(PD14) D1(PD13) D2(PD12) J8(CS)* K8(GPIO0)*

### Layout directives
differential pair; differential pair class USB2: MIPI_C_N, MIPI_C_P, MIPI_D0_N, MIPI_D0_P, MIPI_D1_N, MIPI_D1_P, MIPI_D2_N, MIPI_D2_P, MIPI_D3_N, MIPI_D3_P

### Library data of the parts
C35 C41 C42 = CAP_4.7uF_6.3V_0402_20%: as C84 on sheet Power; Mounting Technology: Surface Mount; PackageReference: 0402; PackageDescription: 0402 (1005 Metric); Voltage: 6.3V; Tolerance: 20%
C36-C40 C43-C47 = CAP_0.1uF_6.3V_0402_10%: as C76 on sheet Power; Mounting Technology: Surface Mount; PackageReference: 0402; PackageDescription: 0402 (1005 Metric); Voltage: 6.3V; Tolerance: 10%
U2 = TC358748XBG(EL): IC MIPI CSI2 TO PARALLEL 80VFBGA; Manufacturer: Toshiba Semiconductor; PartNumber: TC358748XBG(EL); Mounting Technology: Surface Mount; PackageReference: BGA-80
Y3 = KC2016K32.0000C1GE00: as Y2 on sheet MCU; PartNumber: KC2016K32.0000C1GE00; Mounting Technology: Surface Mount; PackageReference: SMD-4

## Sheet MLX75123.SchDoc
size A
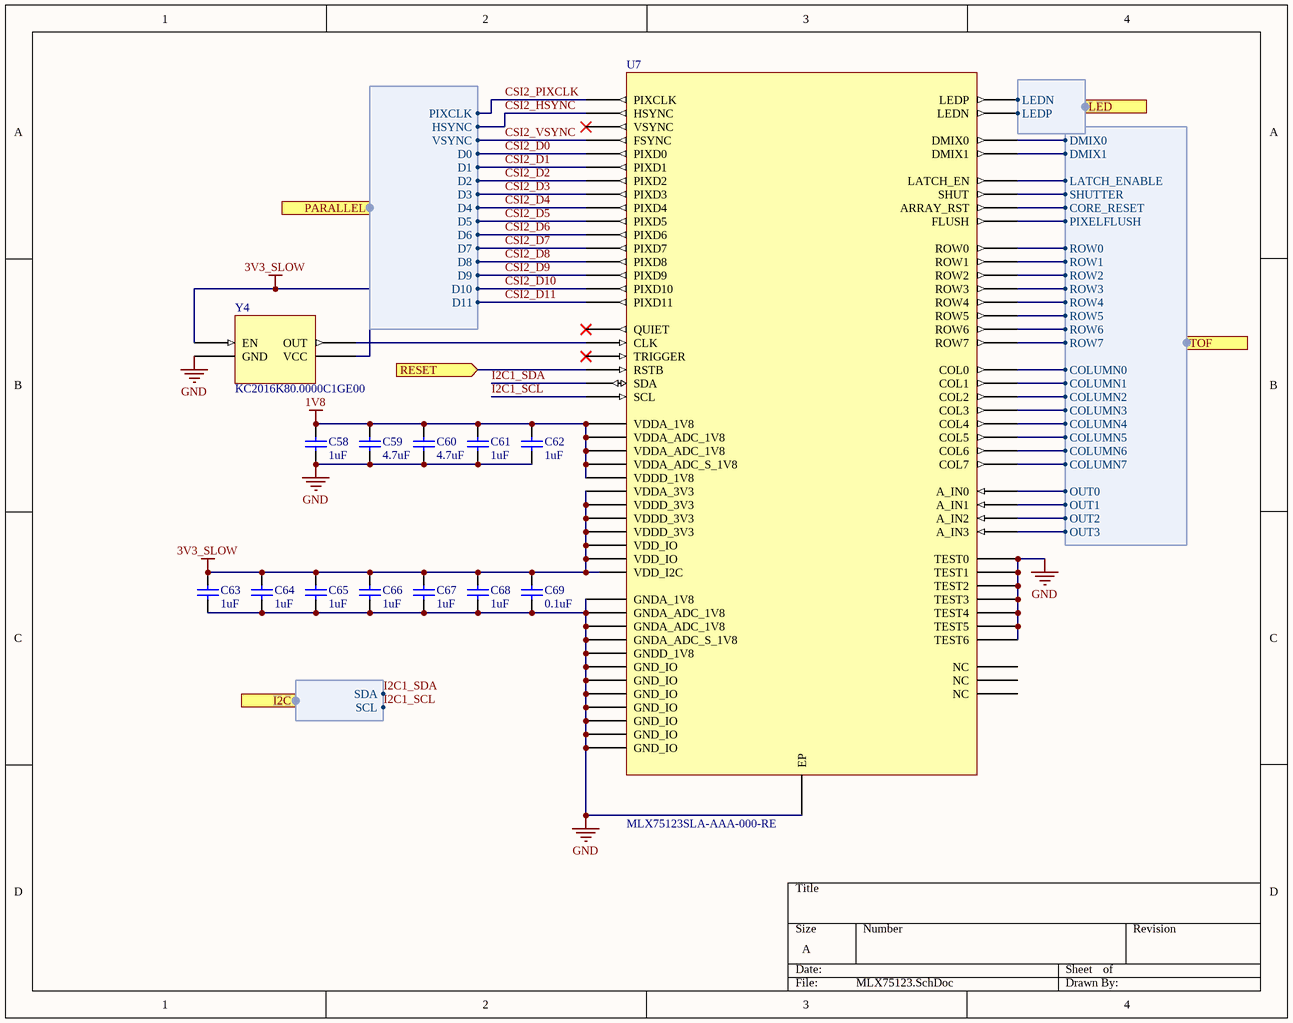
[diagram p5: MLX75123.SchDoc]

### Parts
(Parts that share a designator on the sheet are numbered #1, #2 ... from top to bottom, then left to right.)
C58#1  value 1uF  [C0402[1005X55]]  (hidden comment: 1uF 6.3V 0402)
C59#1  value 4.7uF  [C0402[1005X55]]  (hidden comment: 4.7uF 6.3V 0402)
C60  value 4.7uF  [C0402[1005X55]]  (hidden comment: 4.7uF 6.3V 0402)
C61  value 1uF  [C0402[1005X55]]  (hidden comment: 1uF 6.3V 0402)
C62  value 1uF  [C0402[1005X55]]  (hidden comment: 1uF 6.3V 0402)
C63  value 1uF  [C0402[1005X55]]  (hidden comment: 1uF 6.3V 0402)
C64  value 1uF  [C0402[1005X55]]  (hidden comment: 1uF 6.3V 0402)
C65  value 1uF  [C0402[1005X55]]  (hidden comment: 1uF 6.3V 0402)
C66  value 1uF  [C0402[1005X55]]  (hidden comment: 1uF 6.3V 0402)
C67  value 1uF  [C0402[1005X55]]  (hidden comment: 1uF 6.3V 0402)
C68  value 1uF  [C0402[1005X55]]  (hidden comment: 1uF 6.3V 0402)
C69  value 0.1uF  [C0402[1005X55]]  (hidden comment: 0.1uF 6.3V 0402)
U7  MLX75123SLA-AAA-000-RE  [AQFN-84]
Y4  KC2016K80.0000C1GE00  [KC2016K]

### Ports
I2C (harness I2C), LED (harness LED), PARALLEL (harness Parallel), RESET (in), TOF (harness TOF)

### Harnesses
Parallel: D2, D3, D1, D0, D6, D7, D5, D4, D10, D9, D8, PIXCLK, D11, HSYNC, VSYNC
I2C: SCL, SDA
TOF: DMIX1, DMIX0, SHUTTER, COLUMN0, COLUMN1, COLUMN2, COLUMN4, COLUMN3, COLUMN5, COLUMN6, COLUMN7, LATCH_ENABLE, ROW0, ROW1, ROW2, ROW3, ROW4, ROW5, ROW6, ROW7, CORE_RESET, PIXELFLUSH, OUT0, OUT1, OUT2, OUT3
LED: LEDP, LEDN

### Nets
1V8: C58#1.2 C59#1.2 C60.2 C61.2 C62.2 U7.A9(VDDA_ADC_1V8) U7.A10(VDDA_ADC_S_1V8) U7.B5(VDDA_ADC_1V8) U7.B14(VDDA_1V8) U7.B20(VDDD_1V8)
3V3_SLOW: C63.2 C64.2 C65.2 C66.2 C67.2 C68.2 C69.2 U7.A36(VDDD_3V3) U7.B4(VDDA_3V3) U7.B12(VDD_I2C) U7.B17(VDDD_3V3) U7.B21(VDD_IO) U7.B30(VDD_IO) U7.B38(VDDD_3V3) Y4.1(EN) Y4.4(VCC)
GND: C58#1.1 C59#1.1 C60.1 C61.1 C62.1 C63.1 C64.1 C65.1 C66.1 C67.1 C68.1 C69.1 U7.A5(GNDA_ADC_1V8) U7.A8(GND_IO) U7.A11(TEST5) U7.A16(GNDA_1V8) U7.A17(TEST3) U7.A18(GND_IO) U7.A21(TEST0) U7.A22(GNDD_1V8) U7.A24(GND_IO) U7.A33(GND_IO) U7.A41(GND_IO) U7.B8(GNDA_ADC_1V8) U7.B9(GNDA_ADC_S_1V8) U7.B10(TEST6) U7.B15(GND_IO) U7.B16(TEST4) U7.B18(TEST2) U7.B19(TEST1) U7.B33(GND_IO) U7.EP Y4.2(GND)
COLUMN0: U7.B37(COL0) ; port TOF.COLUMN0
COLUMN1: U7.A40(COL1) ; port TOF.COLUMN1
COLUMN2: U7.B36(COL2) ; port TOF.COLUMN2
COLUMN3: U7.A39(COL3) ; port TOF.COLUMN3
COLUMN4: U7.B35(COL4) ; port TOF.COLUMN4
COLUMN5: U7.A38(COL5) ; port TOF.COLUMN5
COLUMN6: U7.B34(COL6) ; port TOF.COLUMN6
COLUMN7: U7.A37(COL7) ; port TOF.COLUMN7
CORE_RESET: U7.A3(ARRAY_RST) ; port TOF.CORE_RESET
CSI2_D0: U7.A30(PIXD0) ; port PARALLEL.D0
CSI2_D1: U7.B27(PIXD1) ; port PARALLEL.D1
CSI2_D2: U7.A29(PIXD2) ; port PARALLEL.D2
CSI2_D3: U7.B26(PIXD3) ; port PARALLEL.D3
CSI2_D4: U7.A28(PIXD4) ; port PARALLEL.D4
CSI2_D5: U7.B25(PIXD5) ; port PARALLEL.D5
CSI2_D6: U7.A27(PIXD6) ; port PARALLEL.D6
CSI2_D7: U7.B24(PIXD7) ; port PARALLEL.D7
CSI2_D8: U7.A26(PIXD8) ; port PARALLEL.D8
CSI2_D9: U7.B23(PIXD9) ; port PARALLEL.D9
CSI2_D10: U7.A25(PIXD10) ; port PARALLEL.D10
CSI2_D11: U7.B22(PIXD11) ; port PARALLEL.D11
CSI2_HSYNC: U7.B29(HSYNC) ; port PARALLEL.HSYNC
CSI2_PIXCLK: U7.B28(PIXCLK) ; port PARALLEL.PIXCLK
CSI2_VSYNC: U7.A31(FSYNC) ; port PARALLEL.VSYNC
DMIX0: U7.A35(DMIX0) ; port TOF.DMIX0
DMIX1: U7.B32(DMIX1) ; port TOF.DMIX1
I2C1_SCL: U7.A12(SCL) ; port I2C.SCL
I2C1_SDA: U7.B11(SDA) ; port I2C.SDA
LATCH_ENABLE: U7.A4(LATCH_EN) ; port TOF.LATCH_ENABLE
LEDN: U7.B31(LEDP) ; port LED.LEDN
LEDP: U7.A34(LEDN) ; port LED.LEDP
OUT0: U7.B6(A_IN0) ; port TOF.OUT0
OUT1: U7.A6(A_IN1) ; port TOF.OUT1
OUT2: U7.A7(A_IN2) ; port TOF.OUT2
OUT3: U7.B7(A_IN3) ; port TOF.OUT3
PIXELFLUSH: U7.B3(FLUSH) ; port TOF.PIXELFLUSH
ROW0: U7.A42(ROW0) ; port TOF.ROW0
ROW1: U7.B39(ROW1) ; port TOF.ROW1
ROW2: U7.A43(ROW2) ; port TOF.ROW2
ROW3: U7.B40(ROW3) ; port TOF.ROW3
ROW4: U7.A44(ROW4) ; port TOF.ROW4
ROW5: U7.A1(ROW5) ; port TOF.ROW5
ROW6: U7.B1(ROW6) ; port TOF.ROW6
ROW7: U7.A2(ROW7) ; port TOF.ROW7
SHUTTER: U7.B2(SHUT) ; port TOF.SHUTTER
NetU1_F4: U7.A14(RSTB) ; port RESET
NetU7_B13: U7.B13(CLK) Y4.3(OUT)

Not connected (* = marked no-connect by the designer): U7 A13(TRIGGER)* A15(QUIET)* A19(NC) A20(NC) A23(NC) A32(VSYNC)*

### Library data of the parts
C58#1 C61-C68 = CAP_1uF_6.3V_0402_10%: as C88 on sheet Power; Mounting Technology: Surface Mount; PackageReference: 0402; PackageDescription: 0402 (1005 Metric); Voltage: 6.3V; Tolerance: 10%
C59#1 C60 = CAP_4.7uF_6.3V_0402_20%: as C84 on sheet Power; Mounting Technology: Surface Mount; PackageReference: 0402; PackageDescription: 0402 (1005 Metric); Voltage: 6.3V; Tolerance: 20%
C69 = CAP_0.1uF_6.3V_0402_10%: as C76 on sheet Power; Mounting Technology: Surface Mount; PackageReference: 0402; PackageDescription: 0402 (1005 Metric); Voltage: 6.3V; Tolerance: 10%
U7 = MLX75123SLA-AAA-000-RE: Sensor Interface ToF Companion Chip; Manufacturer: Melexis; PackageReference: AQFN-84; Mounting Technology: Surface Mount; PartNumber: MLX75123SLA-AAA-000-RE
Y4 = KC2016K80.0000C1GE00: OSC XO 80.0000MHZ CMOS SMD; Manufacturer: AVX; PartNumber: KC2016K80.0000C1GE00; Mounting Technology: Surface Mount; PackageReference: SMD-4

## Sheet MLX75023.SchDoc
size A
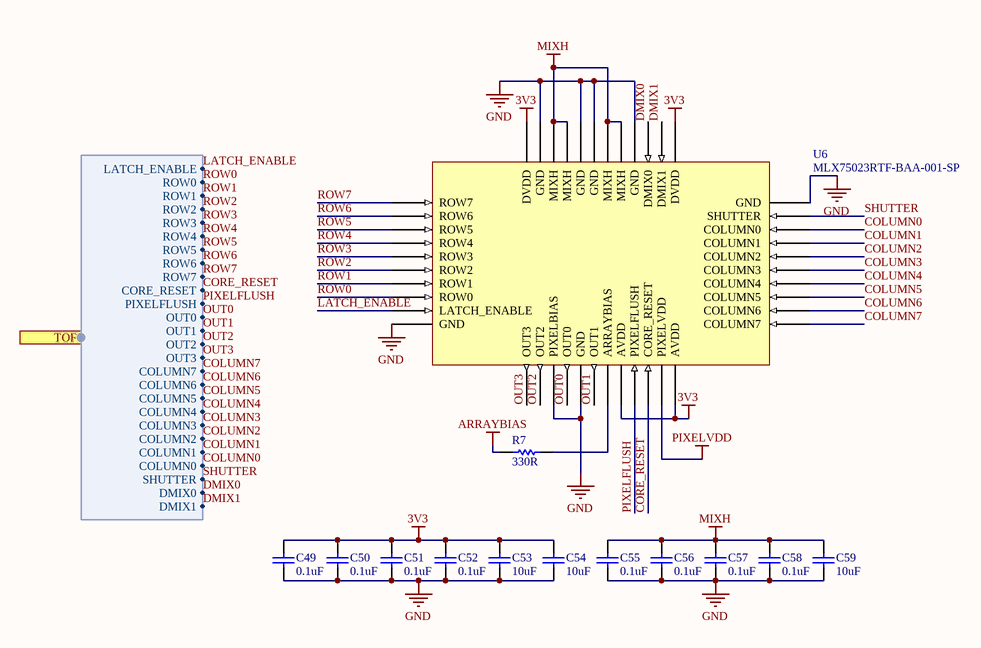
[diagram p6: MLX75023.SchDoc]

### Parts
(Parts that share a designator on the sheet are numbered #1, #2 ... from top to bottom, then left to right.)
C49  value 0.1uF  [C0402[1005X55]]  (hidden comment: 0.1uF 6.3V 0402)
C50  value 0.1uF  [C0402[1005X55]]  (hidden comment: 0.1uF 6.3V 0402)
C51  value 0.1uF  [C0402[1005X55]]  (hidden comment: 0.1uF 6.3V 0402)
C52  value 0.1uF  [C0402[1005X55]]  (hidden comment: 0.1uF 6.3V 0402)
C53  value 10uF  [C0402[1005X55]]  (hidden comment: 10uF 6.3V 0402)
C54  value 10uF  [C0402[1005X55]]  (hidden comment: 10uF 6.3V 0402)
C55  value 0.1uF  [C0402[1005X55]]  (hidden comment: 0.1uF 6.3V 0402)
C56  value 0.1uF  [C0402[1005X55]]  (hidden comment: 0.1uF 6.3V 0402)
C57  value 0.1uF  [C0402[1005X55]]  (hidden comment: 0.1uF 6.3V 0402)
C58#2  value 0.1uF  [C0402[1005X55]]  (hidden comment: 0.1uF 6.3V 0402)
C59#2  value 10uF  [C0402[1005X55]]  (hidden comment: 10uF 6.3V 0402)
R7  value 330R  [R0402[1005]]  (hidden comment: 330R 1% 0402)
U6  MLX75023RTF-BAA-001-SP  [BGA-44]

### Ports
TOF (harness TOF)

### Harnesses
TOF: DMIX1, DMIX0, SHUTTER, COLUMN0, COLUMN1, COLUMN2, COLUMN4, COLUMN3, COLUMN5, COLUMN6, COLUMN7, LATCH_ENABLE, ROW0, ROW1, ROW2, ROW3, ROW4, ROW5, ROW6, ROW7, CORE_RESET, PIXELFLUSH, OUT0, OUT1, OUT2, OUT3

### Nets
3V3: C49.2 C50.2 C51.2 C52.2 C53.2 C54.2 U6.18(AVDD) U6.22(AVDD) U6.33(DVDD) U6.44(DVDD)
ARRAYBIAS: R7.1
GND: C49.1 C50.1 C51.1 C52.1 C53.1 C54.1 C55.1 C56.1 C57.1 C58#2.1 C59#2.1 U6.10(GND) U6.13(PIXELBIAS) U6.15(GND) U6.32(GND) U6.36(GND) U6.39(GND) U6.40(GND) U6.43(GND)
MIXH: C55.2 C56.2 C57.2 C58#2.2 C59#2.2 U6.37(MIXH) U6.38(MIXH) U6.41(MIXH) U6.42(MIXH)
PIXELVDD: U6.21(PIXELVDD)
COLUMN0: U6.30(COLUMN0) ; port TOF.COLUMN0
COLUMN1: U6.29(COLUMN1) ; port TOF.COLUMN1
COLUMN2: U6.28(COLUMN2) ; port TOF.COLUMN2
COLUMN3: U6.27(COLUMN3) ; port TOF.COLUMN3
COLUMN4: U6.26(COLUMN4) ; port TOF.COLUMN4
COLUMN5: U6.25(COLUMN5) ; port TOF.COLUMN5
COLUMN6: U6.24(COLUMN6) ; port TOF.COLUMN6
COLUMN7: U6.23(COLUMN7) ; port TOF.COLUMN7
CORE_RESET: U6.20(CORE_RESET) ; port TOF.CORE_RESET
DMIX0: U6.35(DMIX0) ; port TOF.DMIX0
DMIX1: U6.34(DMIX1) ; port TOF.DMIX1
LATCH_ENABLE: U6.9(LATCH_ENABLE) ; port TOF.LATCH_ENABLE
OUT0: U6.14(OUT0) ; port TOF.OUT0
OUT1: U6.16(OUT1) ; port TOF.OUT1
OUT2: U6.12(OUT2) ; port TOF.OUT2
OUT3: U6.11(OUT3) ; port TOF.OUT3
PIXELFLUSH: U6.19(PIXELFLUSH) ; port TOF.PIXELFLUSH
ROW0: U6.8(ROW0) ; port TOF.ROW0
ROW1: U6.7(ROW1) ; port TOF.ROW1
ROW2: U6.6(ROW2) ; port TOF.ROW2
ROW3: U6.5(ROW3) ; port TOF.ROW3
ROW4: U6.4(ROW4) ; port TOF.ROW4
ROW5: U6.3(ROW5) ; port TOF.ROW5
ROW6: U6.2(ROW6) ; port TOF.ROW6
ROW7: U6.1(ROW7) ; port TOF.ROW7
SHUTTER: U6.31(SHUTTER) ; port TOF.SHUTTER
NetR7_2: R7.2 U6.17(ARRAYBIAS)

### Library data of the parts
C49-C52 C55-C57 C58#2 = CAP_0.1uF_6.3V_0402_10%: as C76 on sheet Power; Mounting Technology: Surface Mount; PackageReference: 0402; PackageDescription: 0402 (1005 Metric); Voltage: 6.3V; Tolerance: 10%
C53 C54 C59#2 = CAP_10uF_6.3V_0402_20%: as C71 on sheet Power; Mounting Technology: Surface Mount; PackageReference: 0402; PackageDescription: 0402 (1005 Metric); Voltage: 6.3V; Tolerance: 20%
R7 = RES_330R_0402_1%_1: 330R 0.063W 1% 0402 (1005 Metric); Manufacturer: KOA Speer; PartNumber: RK73H1ETTP3300F; Tolerance: 1%; Power: 0.063W; Mounting Technology: Surface Mount; PackageReference: 0402; PackageDescription: 0402 (1005 Metric); ComponentLink1Description: Datasheet; ComponentLink1URL: http://www.koaspeer.com/catimages/Products/RK73H/RK73H.pdf
U6 = MLX75023RTF-BAA-001-SP: Manufacturer: Melexis; PartNumber: MLX75023RTF-BAA-001-SP; Mounting Technology: Surface Mount; PackageReference: BGA-44

## Nets that join several sheets
1V2: Power (C71.2 L1.2 U8.6), MCU (24 pins), MIPI-Bridge (10 pins)
1V8: Power (C82.2 L4.2 U11.1), MLX75123 (10 pins)
3V3: Power (C80.2 L3.2 R8.2 U10.3), MCU (30 pins), LEDs (5 pins), MIPI-Bridge (15 pins), MLX75023 (10 pins)
3V3_SLOW: Power (C86.1 L5.2 U11.10), MLX75123 (16 pins)
5V: Power (8 pins), LEDs (12 pins)
ARRAYBIAS: Power (C85.2 R10.2 U12.4), MLX75023 (R7.1)
GND: Power (40 pins), MCU (57 pins), LEDs (17 pins), MIPI-Bridge (38 pins), MLX75123 (33 pins), MLX75023 (19 pins)
MIXH: Power (C77.2 C78.2 L2.2 U9.14), MLX75023 (9 pins)
PIXELVDD: Power (C91.2 U13.2 U13.3), MLX75023 (U6.21)
VUSB: Power (17 pins), MCU (C16.2 JP1.1 U1.E10)
COLUMN0: MLX75123 (U7.B37), MLX75023 (U6.30)
COLUMN1: MLX75123 (U7.A40), MLX75023 (U6.29)
COLUMN2: MLX75123 (U7.B36), MLX75023 (U6.28)
COLUMN3: MLX75123 (U7.A39), MLX75023 (U6.27)
COLUMN4: MLX75123 (U7.B35), MLX75023 (U6.26)
COLUMN5: MLX75123 (U7.A38), MLX75023 (U6.25)
COLUMN6: MLX75123 (U7.B34), MLX75023 (U6.24)
COLUMN7: MLX75123 (U7.A37), MLX75023 (U6.23)
CORE_RESET: MLX75123 (U7.A3), MLX75023 (U6.20)
CSI2_D0: MIPI-Bridge (U2.J3), MLX75123 (U7.A30)
CSI2_D1: MIPI-Bridge (U2.K3), MLX75123 (U7.B27)
CSI2_D2: MIPI-Bridge (U2.J2), MLX75123 (U7.A29)
CSI2_D3: MIPI-Bridge (U2.K2), MLX75123 (U7.B26)
CSI2_D4: MIPI-Bridge (U2.J1), MLX75123 (U7.A28)
CSI2_D5: MIPI-Bridge (U2.K1), MLX75123 (U7.B25)
CSI2_D6: MIPI-Bridge (U2.G6), MLX75123 (U7.A27)
CSI2_D7: MIPI-Bridge (U2.G1), MLX75123 (U7.B24)
CSI2_D8: MIPI-Bridge (U2.F2), MLX75123 (U7.A26)
CSI2_D9: MIPI-Bridge (U2.F1), MLX75123 (U7.B23)
CSI2_D10: MIPI-Bridge (U2.E2), MLX75123 (U7.A25)
CSI2_D11: MIPI-Bridge (U2.E1), MLX75123 (U7.B22)
CSI2_HSYNC: MIPI-Bridge (U2.J7), MLX75123 (U7.B29)
CSI2_PIXCLK: MIPI-Bridge (U2.J6), MLX75123 (U7.B28)
CSI2_VSYNC: MIPI-Bridge (U2.K7), MLX75123 (U7.A31)
DMIX0: MLX75123 (U7.A35), MLX75023 (U6.35)
DMIX1: MLX75123 (U7.B32), MLX75023 (U6.34)
I2C1_SCL: MCU (R12.1 U1.D9), MIPI-Bridge (U2.A8), MLX75123 (U7.A12)
I2C1_SDA: MCU (R13.1 U1.D10), MIPI-Bridge (U2.B8), MLX75123 (U7.B11)
LATCH_ENABLE: MLX75123 (U7.A4), MLX75023 (U6.9)
LEDN: LEDs (U5.14 U5.16 U5.20), MLX75123 (U7.B31)
LEDP: LEDs (U5.15 U5.17 U5.21), MLX75123 (U7.A34)
MIPI_C_N: MCU (U1.K7), MIPI-Bridge (U2.F10)
MIPI_C_P: MCU (U1.J7), MIPI-Bridge (U2.F9)
MIPI_D0_N: MCU (U1.K5), MIPI-Bridge (U2.J10)
MIPI_D0_P: MCU (U1.J5), MIPI-Bridge (U2.J9)
MIPI_D1_N: MCU (U1.K6), MIPI-Bridge (U2.G10)
MIPI_D1_P: MCU (U1.J6), MIPI-Bridge (U2.G9)
MIPI_D2_N: MCU (U1.J9), MIPI-Bridge (U2.D10)
MIPI_D2_P: MCU (U1.J8), MIPI-Bridge (U2.D9)
MIPI_D3_N: MCU (U1.K8), MIPI-Bridge (U2.C10)
MIPI_D3_P: MCU (U1.L8), MIPI-Bridge (U2.C9)
NetU1_F4: MCU (U1.F4), MIPI-Bridge (U2.B9), MLX75123 (U7.A14)
OUT0: MLX75123 (U7.B6), MLX75023 (U6.14)
OUT1: MLX75123 (U7.A6), MLX75023 (U6.16)
OUT2: MLX75123 (U7.A7), MLX75023 (U6.12)
OUT3: MLX75123 (U7.B7), MLX75023 (U6.11)
PIXELFLUSH: MLX75123 (U7.B3), MLX75023 (U6.19)
ROW0: MLX75123 (U7.A42), MLX75023 (U6.8)
ROW1: MLX75123 (U7.B39), MLX75023 (U6.7)
ROW2: MLX75123 (U7.A43), MLX75023 (U6.6)
ROW3: MLX75123 (U7.B40), MLX75023 (U6.5)
ROW4: MLX75123 (U7.A44), MLX75023 (U6.4)
ROW5: MLX75123 (U7.A1), MLX75023 (U6.3)
ROW6: MLX75123 (U7.B1), MLX75023 (U6.2)
ROW7: MLX75123 (U7.A2), MLX75023 (U6.1)
SHUTTER: MLX75123 (U7.B2), MLX75023 (U6.31)